# EAGLE design lp_basic (EAGLE 7.5.0)
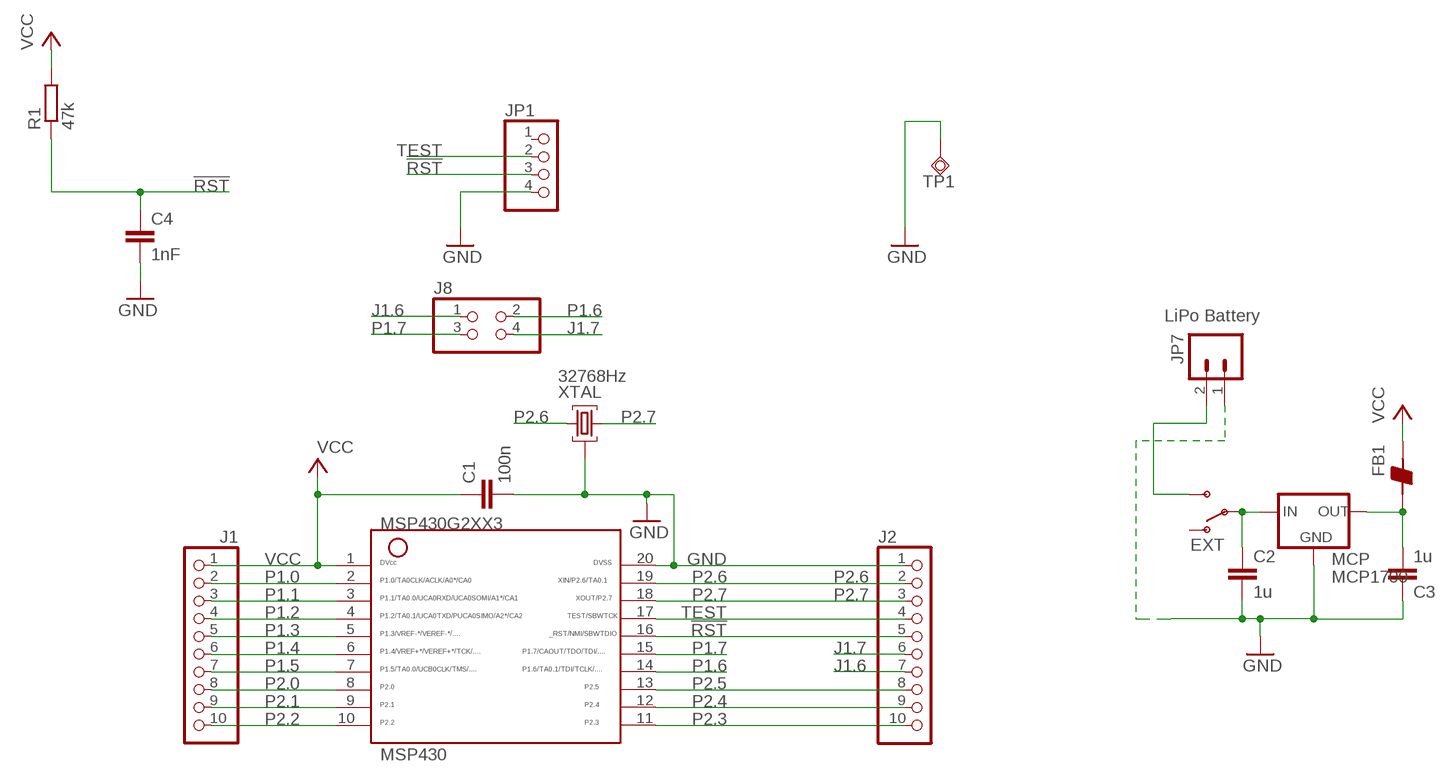
[diagram p0: schematic, sheet 1]

## Parts
C1  100n  C-EUC0805  [C0805]
C2  1u  C-EUC0805  [C0805]
C3  1u  C-EUC0805  [C0805]
C4  1nF  C-EUC0805  [C0805]
FB1  BEAD-0805  [0805]
J1  PH1X10OCT076  [PH1X10OCT76]
J2  PH1X10OCT076  [PH1X10OCT76]
J8  PINHD-2X2  [2X02]
JP1  PINHD-1X4  [1X04]
JP7  LiPo Battery  M02JST-PTH-2  [JST-2-PTH]
MCP  MCP1700  MCP1700SOT-23  [SOT-23]
MSP430  MSP430N  G2XX3---N20HEX  [DIP20_HEX]
ON  EXT  SWITCH-SPSTPTH  [SWITCH-SPDT]
R1  47k  R-EU_R0805  [R0805]
TP1  TPSQTP20R  [TP20R]
XTAL  32768Hz  QUARZ5  [QUARZ5]

## Nets
!RST: C4.1 J2.5 JP1.3 MSP430.16 R1.1
GND [GND]: C1.2 C2.2 C3.1 C4.2 J2.1 JP1.4 JP7.1 MCP.1(GND) MSP430.20 TP1.TP XTAL.GND@0
J1.6: J2.7 J8.1
J1.7: J2.6 J8.4
N$3 [VCC]: C2.1 MCP.3(IN) ON.2(P)
N$6 [VCC]: C3.2 FB1.1 MCP.2(OUT)
P1.0: J1.2 MSP430.2
P1.1: J1.3 MSP430.3
P1.2: J1.4 MSP430.4
P1.3: J1.5 MSP430.5
P1.4: J1.6 MSP430.6
P1.5: J1.7 MSP430.7
P1.6: J8.2 MSP430.14
P1.7: J8.3 MSP430.15
P2.0: J1.8 MSP430.8
P2.1: J1.9 MSP430.9
P2.2: J1.10 MSP430.10
P2.3: J2.10 MSP430.11
P2.4: J2.9 MSP430.12
P2.5: J2.8 MSP430.13
P2.6: J2.2 MSP430.19 XTAL.2
P2.7: J2.3 MSP430.18 XTAL.1
TEST: J2.4 JP1.2 MSP430.17
VCC [VCC]: C1.1 FB1.2 J1.1 MSP430.1 R1.2
VCCEXT [VCC]: JP7.2 ON.3(S)
Unconnected: JP1.1 ON.1(O)

## Library data of the parts
C1-C3 = rcl:C-EU: CAPACITOR, European symbol
C4 = resistor:C-EU: CAPACITOR, European symbol
FB1 = CH_passive:BEAD
J1 J2 = MY_CONN:PH1X10
J8 = pinhead:PINHD-2X2: PIN HEADER
JP1 = pinhead:PINHD-1X4: PIN HEADER
JP7 = SparkFun:M02: Header 2 Standard 2-pin 0.1" header. Use with straight break away headers (SKU : PRT-00116), right angle break away headers (PRT-00553), swiss pins (PRT-00743), machine pins (PRT-00117), and female headers (PRT-00115). Molex polarized connector foot print use with SKU : PRT-08233 with associated crimp pins and housings.
MCP = MY_IC:MCP1700
MSP430 = TI_MSP430_v16:G2XX3---N20: MSP430G2XX1 PDIP (N) 20 Pin Package
ON = SparkFun:SWITCH-SPST: SPST Switch Simple slide switch. Spark Fun Electronics SKU : COM-00102
R1 = resistor:R-EU_: RESISTOR, European symbol
TP1 = testpad:TPSQ: Test pad
XTAL = my_xtal:QUARZ5

## Net classes
0 default: width 0.406 mm, drill 0.508 mm
1 GND: width 0.508 mm, drill 0.508 mm
2 VCC: width 1.016 mm, drill 0.508 mm
4 VCCEXT: width 0.762 mm, drill 0.508 mm, clearance 0.229 mm

## Board
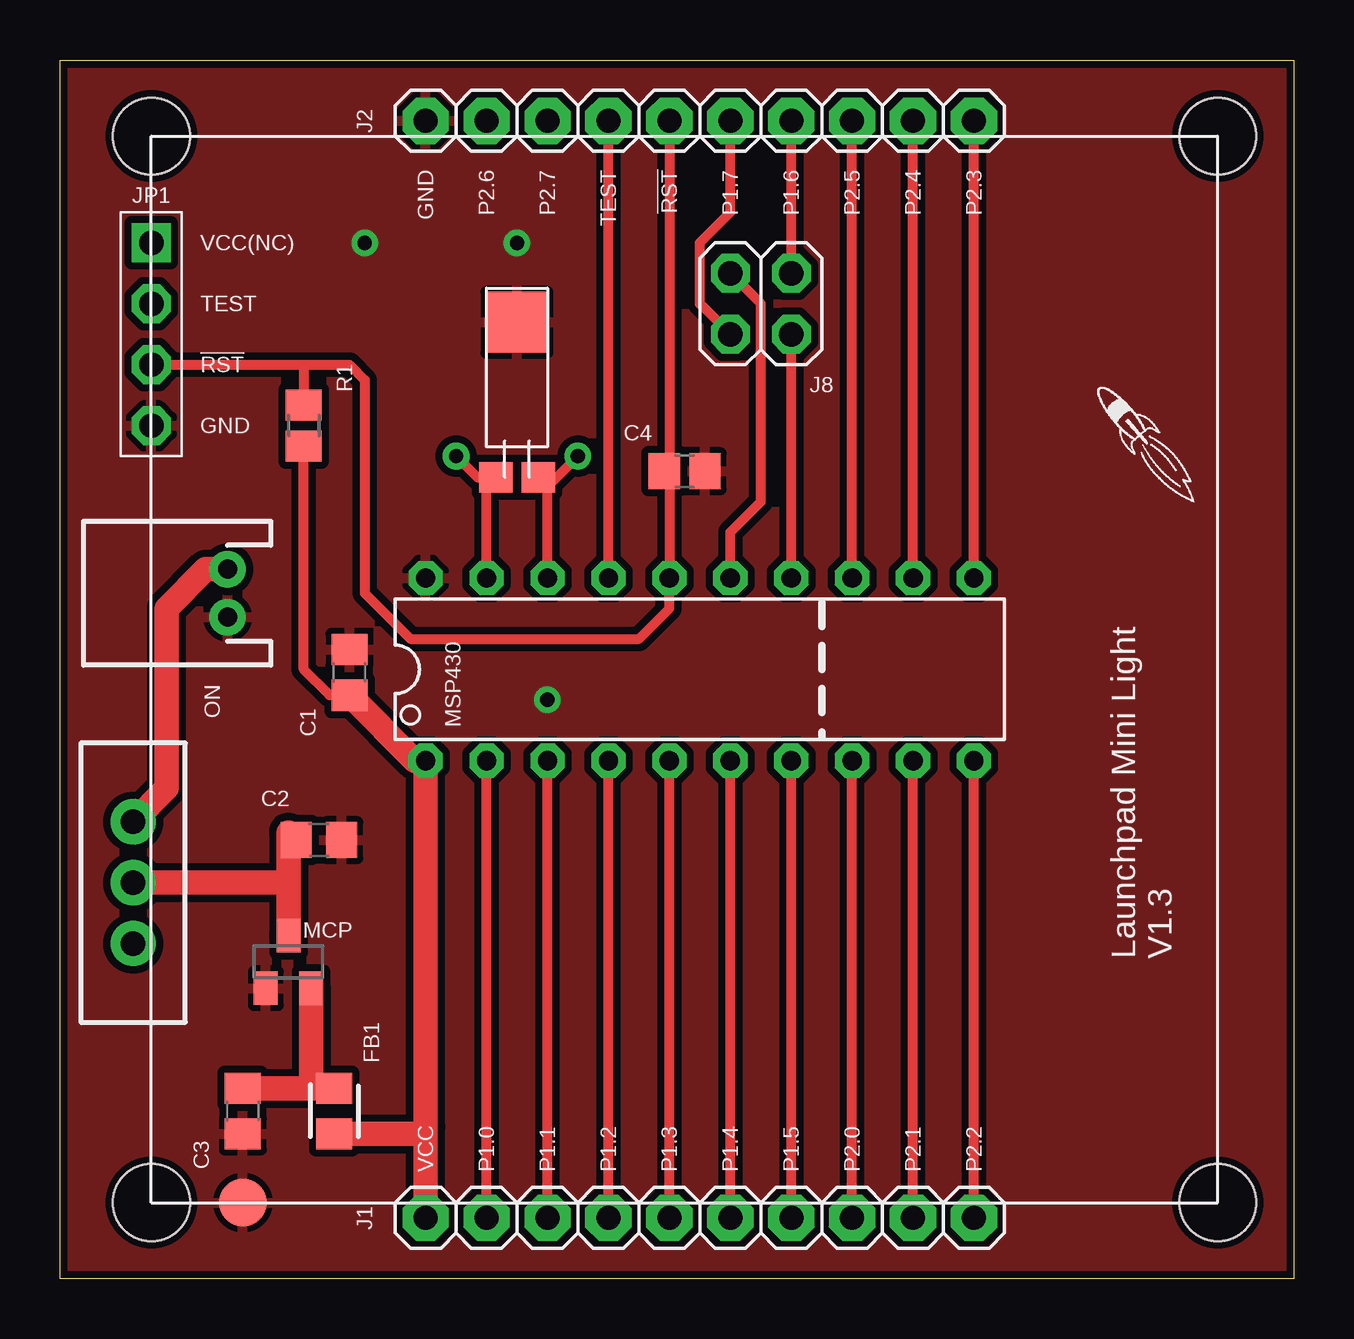
[diagram p1: board, top side]
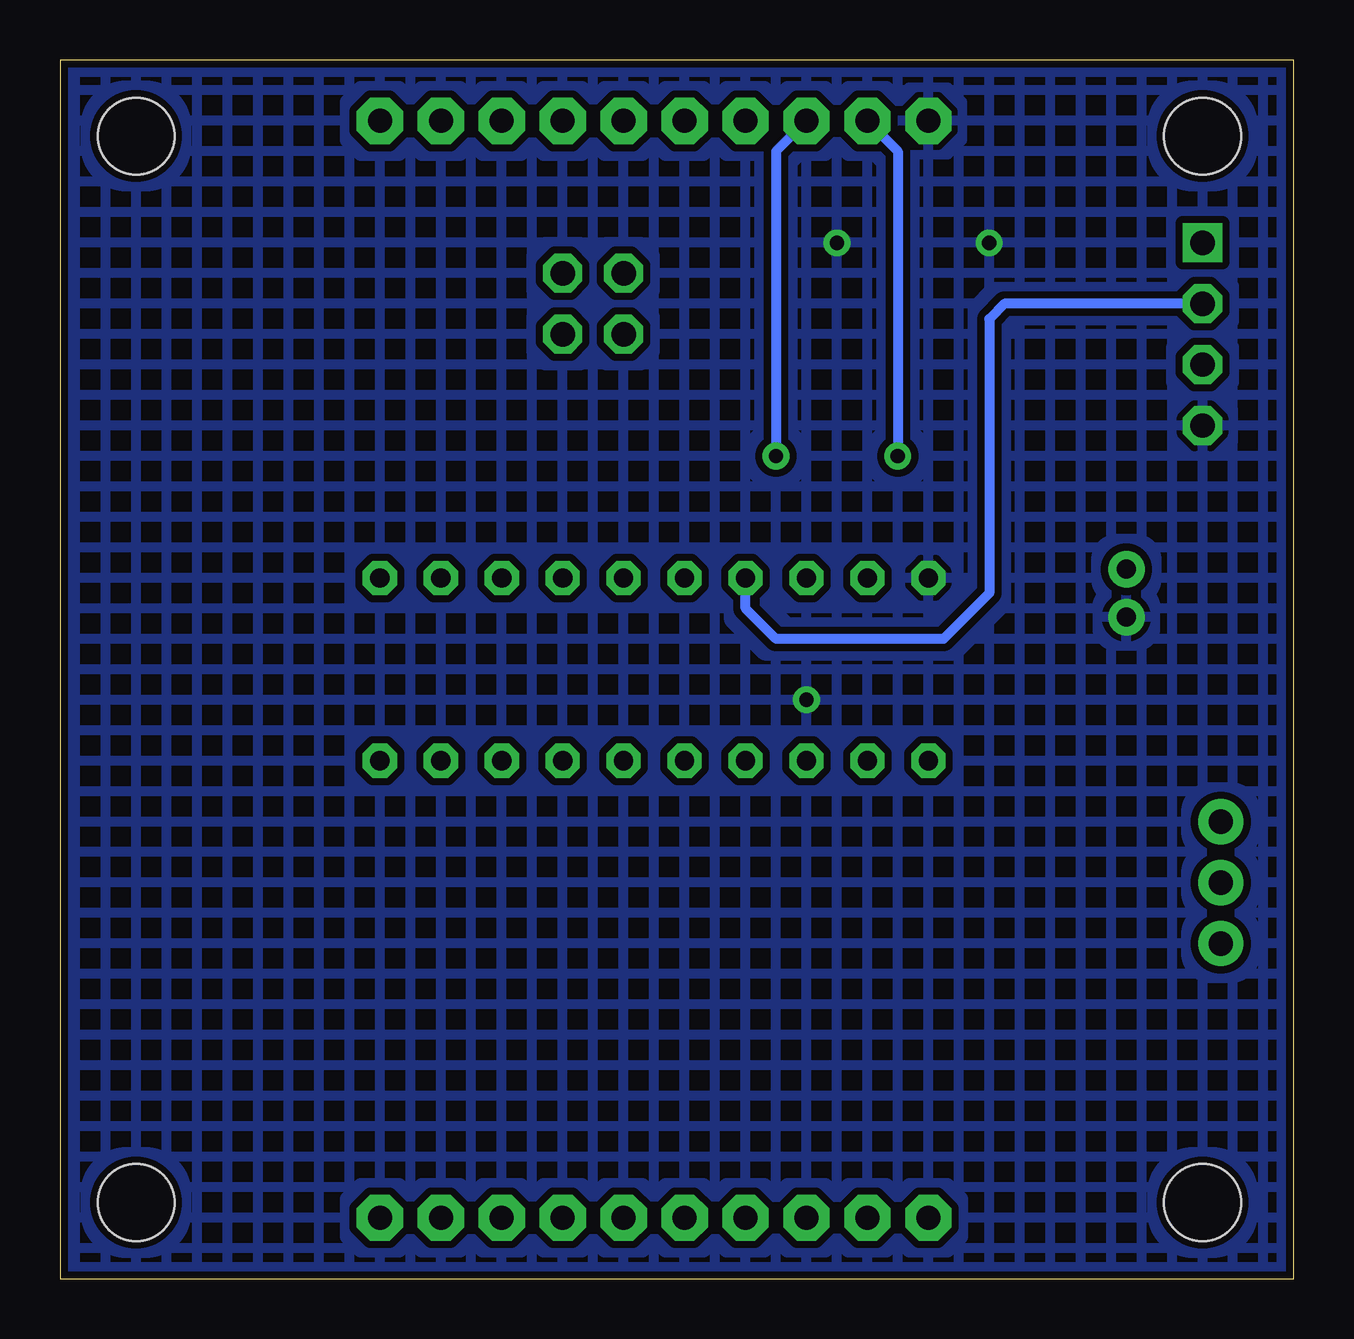
[diagram p2: board, bottom side, seen from below]

Size 51.44 x 50.8 mm. Coordinates in mm from the lower left corner, seen from the top.
Outline: 0,50.8 51.44,50.8 51.44,0 0,0 0,50.8
Copper layers (1*16): Top 0.035mm / dielectric 1.5mm / Bottom 0.035mm
Design rules "SparkFun": minimum track width 8mil, minimum drill 20mil, track to track 8mil, track to pad 8mil, pad to pad 8mil, via to via 8mil, smd to smd 8mil, copper to edge 10mil, drill to drill 8mil, minimum pad ring 12mil, minimum via ring 10mil, stop-mask expansion 4mil, vias tented up to drill 25mil, thermal gap 10mil

### Footprints (pad centres in the part's own frame; a part is rotated, then mirrored left to right if it is on the bottom)
C0805 = smd 1.3 x 1.5: 1 -0.95,0; 2 0.95,0
C0805' = smd 1.3 x 1.5: 1 -0.85,0; 2 0.85,0
0805 = smd 1.3 x 1.5: 1 -0.95,0; 2 0.95,0
PH1X10OCT76 = drill 1 pad 1.93 octagon: 1 0,0; 2 2.54,0; 3 5.08,0; 4 7.62,0; 5 10.16,0; 6 12.7,0; 7 15.24,0; 8 17.78,0; 9 20.32,0; 10 22.86,0
2X02 = drill 1.016 octagon: 1 -1.27,-1.27; 2 -1.27,1.27; 3 1.27,-1.27; 4 1.27,1.27
1X04 = drill 1.016 square: 1 -3.81,0 | drill 1.016 octagon: 2 -1.27,0; 3 1.27,0; 4 3.81,0
JST-2-PTH = drill 0.787 pad 1.524: 1 -1,0; 2 1,0
SOT-23 = smd 1 x 1.4: 1 -0.95,-1.1; 2 0.95,-1.1; 3 0,1.1
DIP20_HEX = drill 0.8 pad 1.422 octagon: 1 -10.16,-3.81; 2 -7.62,-3.81; 3 -5.08,-3.81; 4 -2.54,-3.81; 5 0,-3.81; 6 2.54,-3.81; 7 5.08,-3.81; 8 7.62,-3.81; 9 10.16,-3.81; 10 12.7,-3.81; 11 12.7,3.81; 12 10.16,3.81; 13 7.62,3.81; 14 5.08,3.81; 15 2.54,3.81; 16 0,3.81; 17 -2.54,3.81; 18 -5.08,3.81; 19 -7.62,3.81; 20 -10.16,3.81
SWITCH-SPDT = drill 1.016 pad 1.88: 1 0,2.54; 2 0,0; 3 0,-2.54
R0805 = smd 1.3 x 1.5: 1 -0.85,0; 2 0.85,0
TP20R = smd 2 x 2: TP 0,0
LP_CANVAS = hole 3.2: 0,0; 44.45,0; 0,44.45; 44.45,44.45
QUARZ5 = smd 1.27 x 1.397: 1 0,0.889; 2 0,-0.889 | smd 2.54 x 2.54: GND@0 -6.465,0

### Placement (x,y rotation side)
C1  12.06,25.27 90 top
C2  10.79,18.29 0 top
C3  7.62,6.99 90 top
C4  1nF  [C0805']  26.04,33.66 0 top
FB1  11.43,6.99 270 top
J1  15.24,2.54 0 top
J2  15.24,48.26 0 top
J8  29.21,40.64 180 top
JP1  3.81,39.37 270 top
JP7  6.99,28.57 90 top
MCP  9.53,13.21 0 top
MSP430  25.4,25.4 0 top
ON  3.05,16.51 180 top
R1  10.16,35.56 270 top
TP1  7.62,3.17 0 top
U$1  [LP_CANVAS]  3.81,3.17 0 top
U$2  [LOGO-ROCKET]  45.09,34.92 90 top
XTAL  19.05,33.4 270 top

### Tracks (layer width: path | path; a pad name or v marks a point on that pad's centre or on a via)
!RST
  Top 0.406: JP1.3 10.16,38.1 | 10.16,38.1 R1.1 | 10.16,38.1 12.06,38.1 12.7,37.47 12.7,28.57 14.61,26.67 24.13,26.67 25.4,27.94 MSP430.16 25.4,33.66 C4.1 25.4,33.87 J2.5
GND  (via drill 0.6)
  other vias: 20.32,24.13 19.05,43.18 12.7,43.18
  pour Top (isolate 0.305): -0.25,-0.51 51.82,-0.51 51.82,51.31 -0.25,51.31
  pour Bottom (isolate 0.305, hatched): -0.25,-0.51 51.82,-0.51 51.82,51.31 -0.25,51.31
J1.6
  Top 0.406: J8.1 J2.7
J1.7
  Top 0.406: J2.6 27.94,44.45 26.67,43.18 26.67,40.64 J8.4
N$3
  Top 1.016: C2.1 9.53,18.6 9.53,16.51 | 9.53,16.51 MCP.3 | ON.2 9.53,16.51
N$6
  Top 1.016: C3.2 10.16,7.93 | 10.16,7.93 FB1.1 | MCP.2 10.47,8.26 10.16,7.93
P1.0
  Top 0.406: J1.2 MSP430.2
P1.1
  Top 0.406: J1.3 MSP430.3
P1.2
  Top 0.406: J1.4 MSP430.4
P1.3
  Top 0.406: J1.5 MSP430.5
P1.4
  Top 0.406: J1.6 MSP430.6
P1.5
  Top 0.406: J1.7 MSP430.7
P1.6
  Top 0.406: MSP430.14 J8.2
P1.7
  Top 0.406: J8.3 29.21,40.64 29.21,32.38 27.94,31.11 MSP430.15
P2.0
  Top 0.406: J1.8 MSP430.8
P2.1
  Top 0.406: J1.9 MSP430.9
P2.2
  Top 0.406: J1.10 MSP430.10
P2.3
  Top 0.406: MSP430.11 J2.10
P2.4
  Top 0.406: MSP430.12 J2.9
P2.5
  Top 0.406: MSP430.13 J2.8
P2.6  (via drill 0.6)
  Top 0.406: MSP430.19 17.78,33.66 18.16,33.66 XTAL.2 17.4,33.4 v16.51,34.29
  Bottom 0.406: J2.2 16.51,46.99 v16.51,34.29
P2.7  (via drill 0.6)
  Top 0.406: MSP430.18 20.32,33.02 | 20.32,33.02 20.32,33.66 19.94,33.66 XTAL.1 | v21.59,34.29 20.32,33.02
  Bottom 0.406: J2.3 21.59,46.99 v21.59,34.29
TEST
  Top 0.406: MSP430.17 J2.4
  Bottom 0.406: JP1.2 12.06,40.64 12.7,40.01 12.7,28.57 14.61,26.67 21.59,26.67 22.86,27.94 MSP430.17
VCC
  Top 0.406: 15.24,1.91 J1.1 | C1.1 11.24,24.32 10.16,25.4 R1.2
  Top 1.016: J1.1 15.24,6.35 | 15.24,6.35 MSP430.1 14.8,21.59 C1.1 | FB1.2 14.93,6.04 15.24,6.35
VCCEXT
  Top 1.016: JP7.2 6.08,29.57 4.45,27.94 4.45,20.45 ON.3

### Text on the board
tPlace: Launchpad Mini Light / V1.3
tNames: GND | P2.6 | P2.7 | TEST | !RST | P1.7 | P1.6 | P2.5 | P2.4 | P2.3 | VCC(NC) | TEST | !RST | GND | ON | VCC | P1.0 | P1.1 | P1.2 | P1.3 | P1.4 | P1.5 | P2.0 | P2.1 | P2.2